# Altium project temperature_and_humidity_controller.PrjPcb
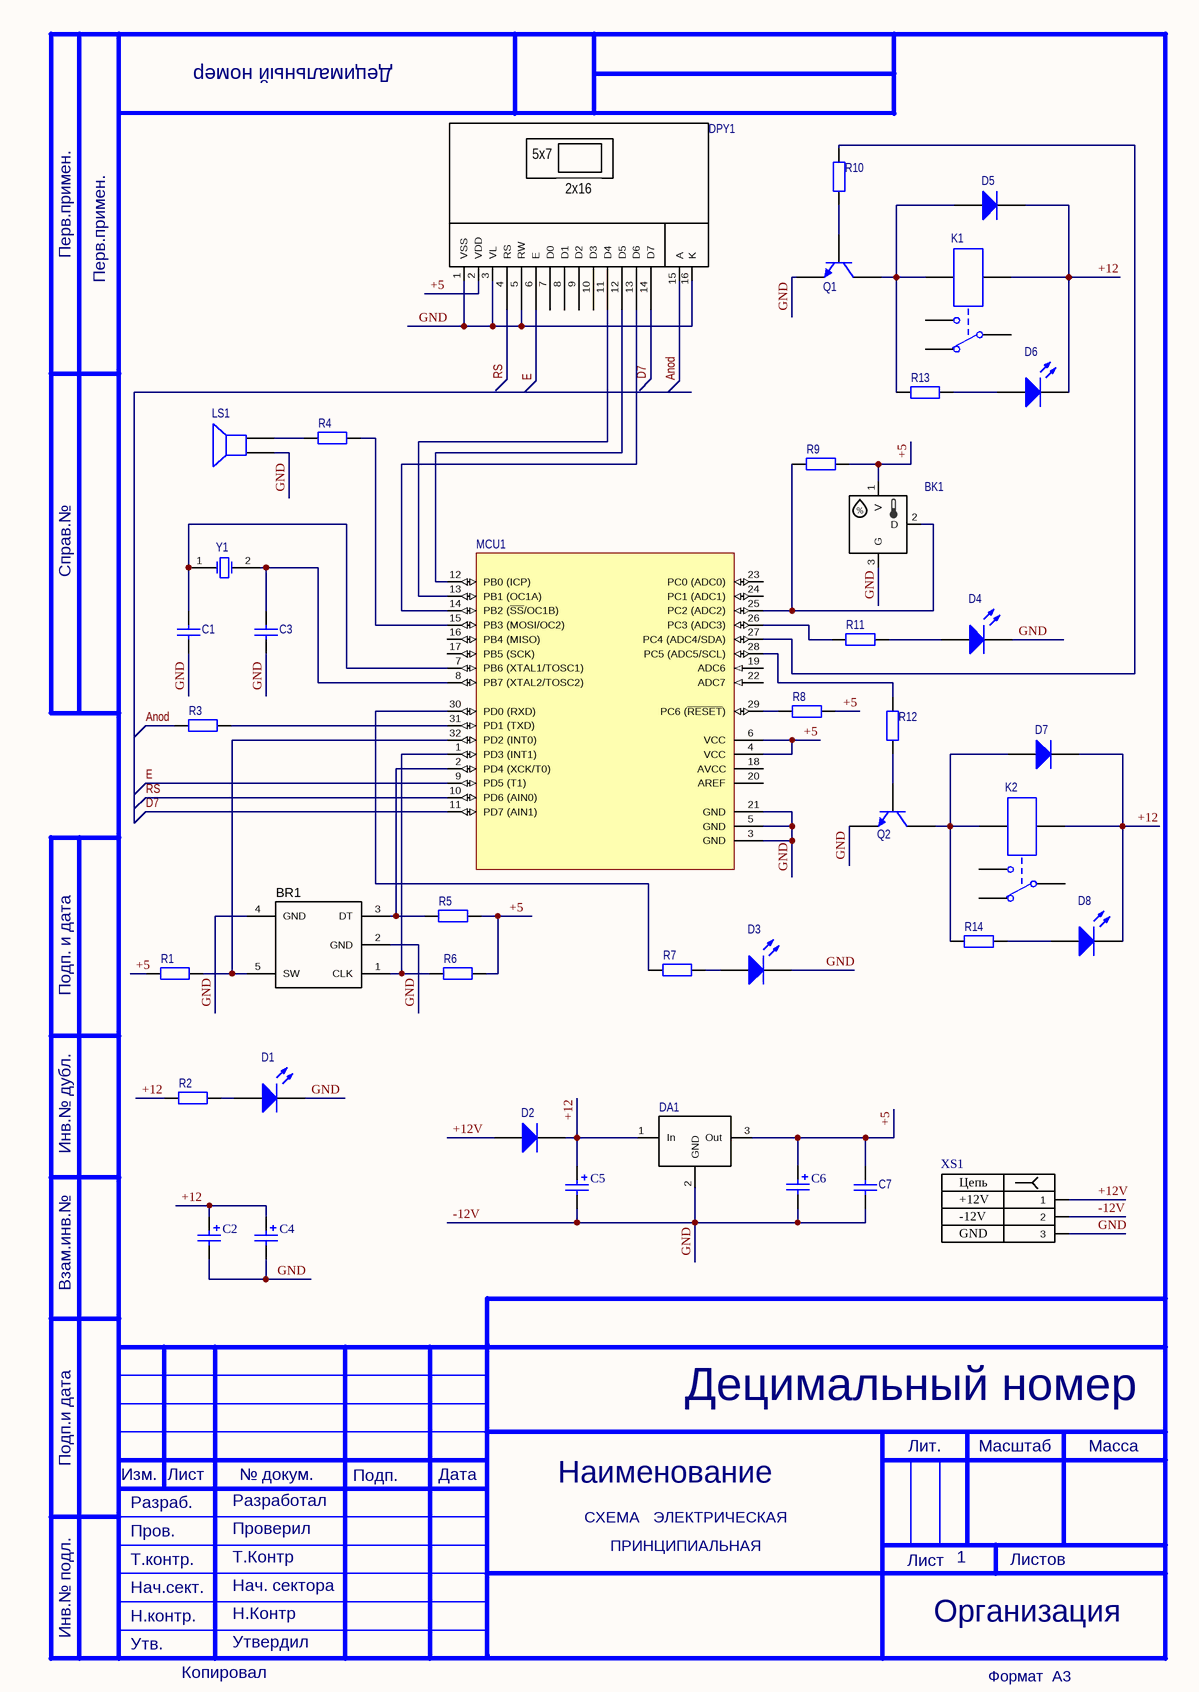
[diagram p0: Schem_controller.SchDoc]
1 sheet, 41 parts. Net scope: global (net labels, ports and power ports of the same name join across sheets).
Board file: Seets_controller.PcbDoc

## Sheet Schem_controller.SchDoc: Наименование
size 209 x 297 mm; Weight: -; ScaleFactor: -; NormInspection: Норм.Контр.; ApprovedBy: Утвердил; CheckedBy: Проверил; Author: Разработал; CompanyName: Организация; DrawnBy: Н.Контр; Engineer: Т.Контр; SheetNumber: 1; SheetTotal: 1; PageSetup: Record=PageOptions|CenterHorizontal=True|CenterVertical=True|PrintScale=0.94|XCorrection=1.00|YCorrection=1.00|PrintKind=1|BorderSize=5000000|LeftOffset=0|BottomOffset=0|Orientation=1|PaperLength=1000|PaperWidth=1000|Scale=100|PaperSource=7|PrintQuality=-4|MediaType=1|DitherType=10|PaperKind=A4|PrintScaleMode=1; DecimalNumber: Децимальный номер; HeadOfSector: Нач. сектора; MainDevice: Перв.примен.; Name: Наименование; DocumentName: Sheet1.SCHDOC

### Parts
BK1  (no value)  [WF_4]
BR1  (no value)  [PEC16-4015F-S0024]  (mechanical)
C1  (no value)  [RAD-0.3]
C2  (no value)  [POLAR0.8]
C3  (no value)  [RAD-0.3]
C4  (no value)  [POLAR0.8]
C5  (no value)  [POLAR0.8]
C6  (no value)  [POLAR0.8]
C7  (no value)  [RAD-0.3]
D1  (no value)  [LED-0]
D2  (no value)  [SMC]
D3  (no value)  [LED-0]
D4  (no value)  [LED-0]
D5  (no value)  [SMC]
D6  (no value)  [LED-0]
D7  (no value)  [SMC]
D8  (no value)  [LED-0]
DA1  (no value)  [TO220]
DPY1  (no value)  [LCDCHAR_16X2_BLU]
K1  (no value)  [MODULE5B]
K2  (no value)  [MODULE5B]
LS1  (no value)  [PIN2]
MCU1  (no value)  [32A_N]
Q1  (no value)  [TO-92A]
Q2  (no value)  [TO-92A]
R1  (no value)  [AXIAL-0.4]
R2  (no value)  [AXIAL-0.4]
R3  (no value)  [AXIAL-0.4]
R4  (no value)  [AXIAL-0.4]
R5  (no value)  [AXIAL-0.4]
R6  (no value)  [AXIAL-0.4]
R7  (no value)  [AXIAL-0.4]
R8  (no value)  [AXIAL-0.4]
R9  (no value)  [AXIAL-0.4]
R10  (no value)  [AXIAL-0.4]
R11  (no value)  [AXIAL-0.4]
R12  (no value)  [AXIAL-0.4]
R13  (no value)  [AXIAL-0.4]
R14  (no value)  [AXIAL-0.4]
XS1  (no value)  [NINIGI_DC-005]
Y1  (no value)  [R38]

### Nets
+5: BK1.1(V) C6.1 C7.2 DA1.3(Out) DPY1.2(VDD) MCU1.4(VCC) MCU1.6(VCC) R1.1 R5.2 R6.2 R8.2 R9.2
+12: C2.1 C4.1 C5.1 D2.2(K) D5.2(K) D6.2(K) D7.2(K) D8.2(K) DA1.1(In) K1.4 K2.4 R2.1
+12V: D2.1(A) XS1.?1(1)
-12V: BK1.3(G) BR1.2(GND) BR1.4(GND) C1.1 C2.2 C3.1 C4.2 C5.2 C6.2 C7.1 D1.2(K) D3.2(K) D4.2(K) DA1.2(GND) DPY1.1(VSS) DPY1.3(VL) DPY1.5(RW) DPY1.16(K) LS1.1 MCU1.3(GND) MCU1.5(GND) MCU1.21(GND) Q1.1(E) Q2.1(E) XS1.?2(2) XS1.?3(3)  [also labelled GND]
Anod: DPY1.15(A) R3.1
D7: DPY1.14(D7) MCU1.11(PD7_(AIN1))
E: DPY1.6(E) MCU1.9(PD5_(T1))
RS: DPY1.4(RS) MCU1.10(PD6_(AIN0))
NetBK1_2: BK1.2(D) MCU1.25(PC2_(ADC2)) R9.1
NetBR1_1: BR1.1(CLK) MCU1.1(PD3_(INT1)) R6.1
NetBR1_3: BR1.3(DT) MCU1.2(PD4_(XCK/T0)) R5.1
NetBR1_5: BR1.5(SW) MCU1.32(PD2_(INT0)) R1.2
NetC1_2: C1.2 MCU1.7(PB6_(XTAL1/TOSC1)) Y1.1(OSC1)
NetC3_2: C3.2 MCU1.8(PB7_(XTAL2/TOSC2)) Y1.2(OSC2)
NetD1_1: D1.1(A) R2.2
NetD3_1: D3.1(A) R7.2
NetD4_1: D4.1(A) R11.2
NetD5_1: D5.1(A) K1.5 Q1.3(C) R13.1
NetD6_1: D6.1(A) R13.2
NetD7_1: D7.1(A) K2.5 Q2.3(C) R14.1
NetD8_1: D8.1(A) R14.2
NetDPY1_11: DPY1.11(D4) MCU1.13(PB1_(OC1A))
NetDPY1_12: DPY1.12(D5) MCU1.12(PB0_(ICP))
NetDPY1_13: DPY1.13(D6) MCU1.14(PB2_(~{SS}/OC1B))
NetLS1_2: LS1.2 R4.1
NetMCU1_15: MCU1.15(PB3_(MOSI/OC2)) R4.2
NetMCU1_26: MCU1.26(PC3_(ADC3)) R11.1
NetMCU1_27: MCU1.27(PC4_(ADC4/SDA)) R10.2
NetMCU1_28: MCU1.28(PC5_(ADC5/SCL)) R12.2
NetMCU1_29: MCU1.29(PC6_(~{RESET})) R8.1
NetMCU1_30: MCU1.30(PD0_(RXD)) R7.1
NetMCU1_31: MCU1.31(PD1_(TXD)) R3.2
NetQ1_2: Q1.2(B) R10.1
NetQ2_2: Q2.2(B) R12.1

Not connected (* = marked no-connect by the designer): DPY1 7(D0) 8(D1) 9(D2) 10(D3) MH1 MH2 MH3 MH4; K1 1 2 3; K2 1 2 3; MCU1 16(PB4_(MISO)) 17(PB5_(SCK)) 18(AVCC) 19(ADC6) 20(AREF) 22(ADC7) 23(PC0_(ADC0)) 24(PC1_(ADC1))

### Notes on the sheet
- Перв.примен.
- Справ.№
- Подп. и дата
- Инв.№ дубл.
- Взам.инв.№
- Подп.и дата
- Разраб.
- Изм.
- Лист
- № докум.
- Подп.
- Дата
- Лит.
- Масштаб
- Масса
- Т.контр.
- Пров.
- СХЕМА   ЭЛЕКТРИЧЕСКАЯ
- ПРИНЦИПИАЛЬНАЯ
- Листов
- Инв.№ подл.
- Утв.
- Н.контр.
- Нач.сект.
- Копировал
- Формат  A3
- (in symbol LCDCHAR_16X2_BLU) 5x7; 2x16
- (in symbol Power_connector) Цепь; +12V; -12V; GND

### Library data of the parts
BK1 = HUM_AM2301: Sensor, Humidity+Temp, Digital, Capacitive; PARAM2: PARAM2
BR1 = ENCODER_OPT_0.25in shaft_with cable: Encoder optical rotary panel mount no pushbutton; Manufacturer 1: CUI Inc; Manufacturer Part Number 1: C14D32N-B3; Ratings: 5VDC; Actuator Type: 1/4" Dia Flatted End; Detent: Yes; Output Type: Quadrature (Incremental); Pulses per Revolution: 16 or 32; Parameter Name: Cable with Connector; Package / Case: Panel Mount; Supplier 1: Digi-Key; Supplier Part Number 1: 102-1913-ND; Built in Switch: No; Encoder Type: Optical; Supplier 2: Digi-Key; Supplier Part Number 2: 102-1922-ND; Manufacturer 2: CUI Inc; Manufacturer Part Number 2: C14D16N-B3; Supplier 3: Digi-Key; Supplier Part Number 3: GH7534-ND; Manufacturer 3: Grayhill Inc; Manufacturer Part Number 3: 62AG22-L0-040C
C1 C3 C7 = Cap: Capacitor; Published: 8-Jun-2000; LatestRevisionDate: 17-Jul-2002; LatestRevisionNote: Re-released for DXP Platform.; PackageReference: RAD-0.3; Publisher: Altium Limited; PackageDescription: Radial Cap, Thru-Hole; 2 Leads; 0.3 in Pin Spacing
C2 C4-C6 = Cap Pol2: Polarized Capacitor (Axial); Published: 8-Jun-2000; LatestRevisionDate: 17-Jul-2002; LatestRevisionNote: Re-released for DXP Platform.; PackageReference: POLAR0.8; Publisher: Altium Limited; PackageDescription: Polarized Capacitor; 2 Leads
D1 D3 D4 D6 D8 = LED0: Typical INFRARED GaAs LED; Published: 8-Jun-2000; LatestRevisionDate: 08-Jul-2005; LatestRevisionNote: Mech Layer 1 removed.; PackageReference: LED-0; Publisher: Altium Limited; PackageDescription: LED; 2 Leads
D2 D5 D7 = Diode: Default Diode; Published: 8-Jun-2000; LatestRevisionDate: 17-Jul-2002; LatestRevisionNote: Re-released for DXP Platform.; PackageVersion: Sep-1996; PackageReference: SMC; Publisher: Altium Limited; PackageDescription: DO-214-AB/SMC; 2 C-Bend Leads; Body 7.9 x 5.9 mm, inc. leads (LxW); Code_JEDEC: DO-214-AB
DA1 = LM7805: IC REG LIN 5V 1A
DPY1 = LCDCHAR_16X2_BLU: LCD Character Disp, 16X2; MANF: Newhaven; MANF_P#: NHD-0216K3Z-NSW-BBW-V3; PARAM2: Blue back, White, 5V; PARAM: 2 lines x 16 characters
K1 K2 = Relay-SPDT: Single-Pole Dual-Throw Relay; Published: 24-Mar-1999; LatestRevisionDate: 17-Jul-2002; LatestRevisionNote: Re-released for DXP Platform.; PackageReference: MODULE5B; Publisher: Altium Limited
LS1 = Speaker: Loudspeaker; Published: 24-Mar-1999; LatestRevisionDate: 17-Jul-2002; LatestRevisionNote: Re-released for DXP Platform.; PackageReference: PIN2; Publisher: Altium Limited
MCU1 = ATmega8-16AC: 8-Bit AVR Microcontroller with 8K Bytes of In-System Programmable Flash Memory; Published: 17-Sep-2003; LatestRevisionDate: 16-Oct-2006; LatestRevisionNote: IPC-7351 Footprint Added.; DatasheetVersion: 2486H-AVR-09/02; PackageVersion: revB, Oct-2001; PackageReference: 32A; Publisher: Altium Limited; PackageDescription: 32-Lead, 7x7x1.0 mm Body, 0.8mm Lead Pitch, Thin Profile Plastic Quad Flat Package (TQFP); Supplier 1: Digi-Key; Supplier Part Number 1: ATMEGA8-16AC-ND; Supplier 2: Mouser; Supplier Part Number 2: 556-ATMEGA8-16AC; Code_JEDEC: MS-026-ABA; ComponentLink1Description: Datasheet; ComponentLink1URL: http://www.atmel.com/dyn/resources/prod_documents/doc2486.pdf; ComponentLink2Description: Atmel.com Home; ComponentLink2URL: http://www.atmel.com
Q1 Q2 = 2N3904: NPN General Purpose Amplifier; Published: 8-Jun-2000; LatestRevisionDate: 15-Jan-2003; LatestRevisionNote: PCB Footprint 'BCY-W3/D4.7' replaced; DatasheetVersion: 1997; PackageVersion: Sep-1998; PackageReference: TO-92A; Publisher: Altium Limited; PackageDescription: TO, Flat Index; 3 In-Line, Axial Leads; Body Dia. 4.5mm; Leads 0.51 x 0.48 mm (max); ComponentLink1Description: Manufacturer Link; ComponentLink1URL: http://www.fairchildsemi.com/; ComponentLink2Description: Datasheet; ComponentLink2URL: http://www.fairchildsemi.com/ds/2N%2F2N3904.pdf
R1-R14 = Res2: Resistor; Published: 8-Jun-2000; LatestRevisionDate: 17-Jul-2002; LatestRevisionNote: Re-released for DXP Platform.; PackageReference: AXIAL-0.4; Publisher: Altium Limited; PackageDescription: Axial Device, Thru-Hole; 2 Leads; 0.4 in Pin Spacing
XS1 = Power_connector
Y1 = XTAL: Crystal Oscillator; Published: 8-Jun-2000; LatestRevisionDate: 17-Jul-2002; LatestRevisionNote: Re-released for DXP Platform.; PackageReference: R38; Publisher: Altium Limited; PackageDescription: Crystal, Thru-Hole; 2 Leads; Body 3.1 x 8.2 mm (Dia.xH)